# Altium schematic sheet system_bus.SchDoc
size A4
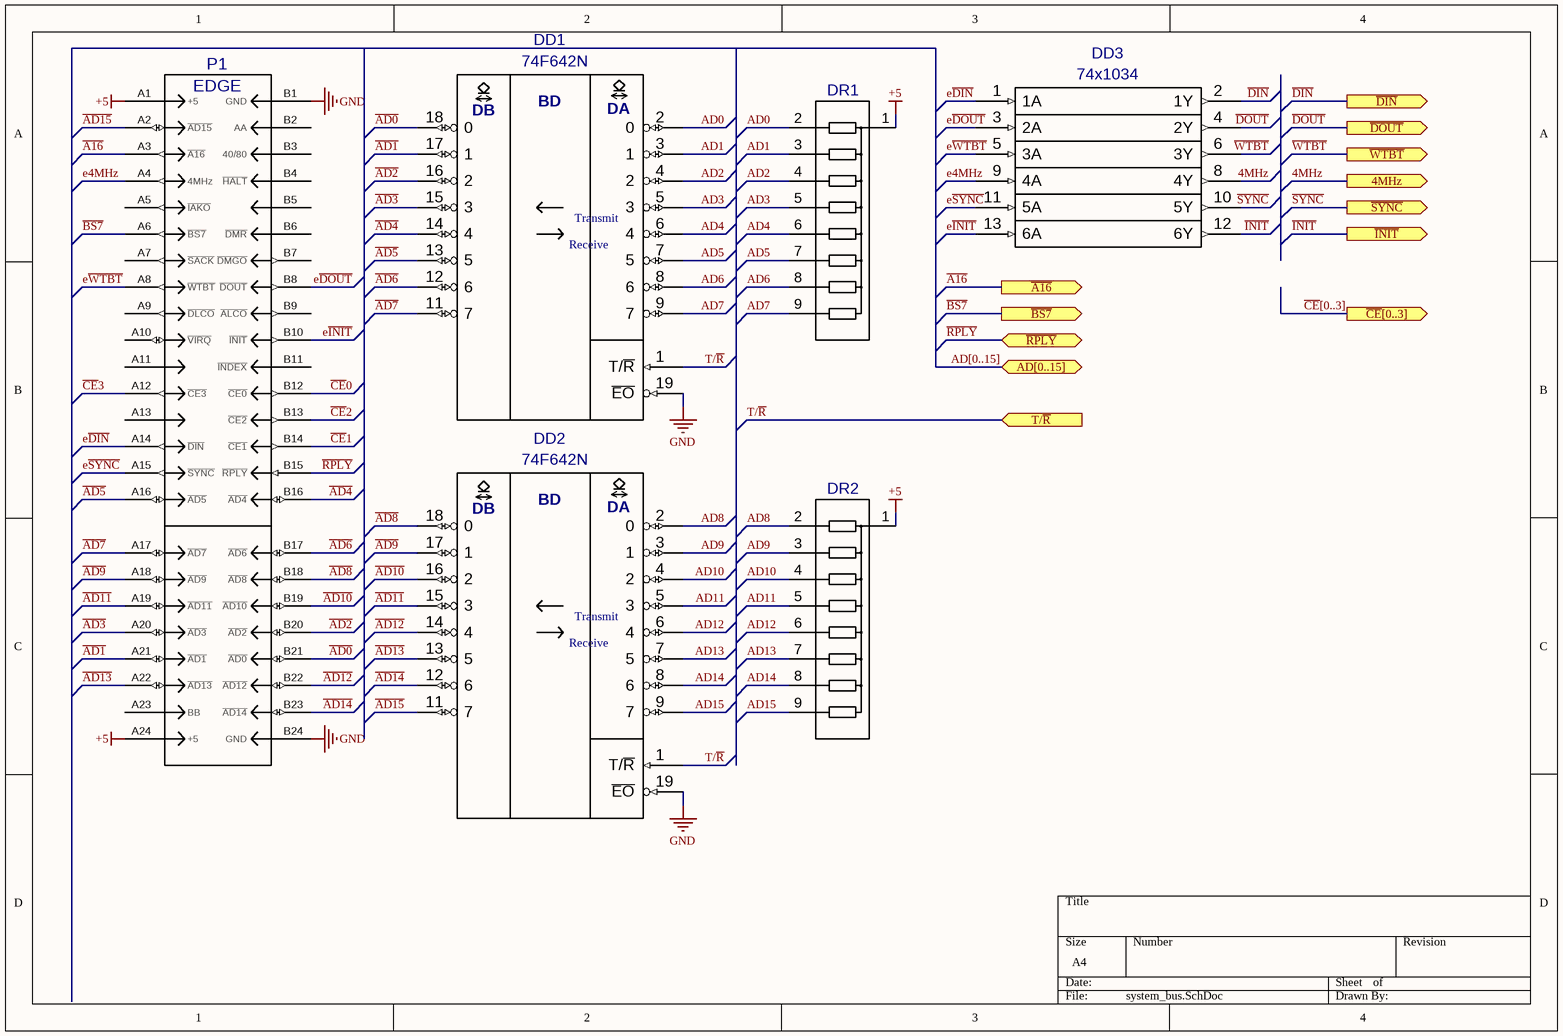
[diagram p0: system_bus.SchDoc]

## Parts
DD1  74F642N  [DIP20]
DD2  74F642N  [DIP20]
DD3  74x1034  [DIP14]
DR1  RNA8  [SIP9]  (value not drawn)
DR2  RNA8  [SIP9]  (value not drawn)
P1  EDGE  [SNP15-48 EDGE]

## Ports
4MHz (out), AD[0..15] (bidir), T/~{R} (in), ~{A16} (out), ~{BS7} (out), ~{CE}[0..3] (out), ~{DIN} (out), ~{DOUT} (out), ~{INIT} (out), ~{RPLY} (bidir), ~{SYNC} (out), ~{WTBT} (out)

## Nets
+5: DD1.20(Vcc) DD2.20(Vcc) DD3.14(+5) DR1.1 DR2.1 P1.A1(+5) P1.A24(+5)
GND: DD1.10(GND) DD1.19(~{EO}) DD2.10(GND) DD2.19(~{EO}) DD3.7(GND) P1.B1(GND) P1.B24(GND)
4MHz: DD3.8(4Y) ; port 4MHz
~{A16}: P1.A3(~{A16}) ; port ~{A16}
~{AD0}: DD1.18(0) P1.B21(~{AD0})
~{AD1}: DD1.17(1) P1.A21(~{AD1})
~{AD10}: DD2.16(2) P1.B19(~{AD10})
~{AD11}: DD2.15(3) P1.A19(~{AD11})
~{AD12}: DD2.14(4) P1.B22(~{AD12})
~{AD13}: DD2.13(5) P1.A22(~{AD13})
~{AD14}: DD2.12(6) P1.B23(~{AD14})
~{AD15}: DD2.11(7) P1.A2(~{AD15})
~{AD2}: DD1.16(2) P1.B20(~{AD2})
~{AD3}: DD1.15(3) P1.A20(~{AD3})
~{AD4}: DD1.14(4) P1.B16(~{AD4})
~{AD5}: DD1.13(5) P1.A16(~{AD5})
~{AD6}: DD1.12(6) P1.B17(~{AD6})
~{AD7}: DD1.11(7) P1.A17(~{AD7})
~{AD8}: DD2.18(0) P1.B18(~{AD8})
~{AD9}: DD2.17(1) P1.A18(~{AD9})
AD0: DD1.2(0) DR1.2
AD1: DD1.3(1) DR1.3
AD2: DD1.4(2) DR1.4
AD3: DD1.5(3) DR1.5
AD4: DD1.6(4) DR1.6
AD5: DD1.7(5) DR1.7
AD6: DD1.8(6) DR1.8
AD7: DD1.9(7) DR1.9
AD8: DD2.2(0) DR2.2
AD9: DD2.3(1) DR2.3
AD10: DD2.4(2) DR2.4
AD11: DD2.5(3) DR2.5
AD12: DD2.6(4) DR2.6
AD13: DD2.7(5) DR2.7
AD14: DD2.8(6) DR2.8
AD15: DD2.9(7) DR2.9
~{BS7}: P1.A6(~{BS7}) ; port ~{BS7}
~{CE}0: P1.B12(~{CE0})
~{CE}1: P1.B14(~{CE1})
~{CE}2: P1.B13(~{CE2})
~{CE}3: P1.A12(~{CE3})
~{DIN}: DD3.2(1Y) ; port ~{DIN}
~{DOUT}: DD3.4(2Y) ; port ~{DOUT}
e4MHz: DD3.9(4A) P1.A4(4MHz)
e~{DIN}: DD3.1(1A) P1.A14(~{DIN})
e~{DOUT}: DD3.3(2A) P1.B8(~{DOUT})
e~{INIT}: DD3.13(6A) P1.B10(~{INIT})
e~{SYNC}: DD3.11(5A) P1.A15(~{SYNC})
e~{WTBT}: DD3.5(3A) P1.A8(~{WTBT})
~{INIT}: DD3.12(6Y) ; port ~{INIT}
~{RPLY}: P1.B15(~{RPLY}) ; port ~{RPLY}
~{SYNC}: DD3.10(5Y) ; port ~{SYNC}
T/~{R}: DD1.1(T/~{R}) DD2.1(T/~{R}) ; port T/~{R}
~{WTBT}: DD3.6(3Y) ; port ~{WTBT}

Not connected (* = marked no-connect by the designer): P1 A5(~{IAKO}) A7(~{SACK}) A9(~{DLCO}) A10(~{VIRQ}) A11 A13 A23(BB) B2(AA) B3(40/80) B4(~{HALT}) B5 B6(~{DMR}) B7(~{DMGO}) B9(~{ALCO}) B11(~{INDEX})

## Buses and harness runs
bus AD[0..15] = port AD[0..15]
bus ~{CE}[0..3] = port ~{CE}[0..3]

## Notes on the sheet
- (in symbol 74x642) BD; DA; DB; Transmit; Receive

## Library data of the parts
DD1 DD2 = 74x642: Value: *
DD3 = 74x1034 IEEE: ЛП19 6 buffers; Value: *
P1 = SNP15-48 EDGE: Value: *